# Altium schematic sheet Power_3V3_LDO.SchDoc
size A4
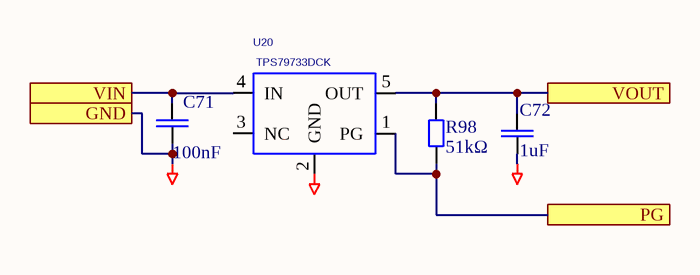
[diagram p0: Power_3V3_LDO.SchDoc]

## Parts
C71  100nF  [CAPC1608N]
C72  1uF  [CAPC2012N]
R98  51kΩ  [RESC2012N]
U20  TPS79733DCK  [SOT65P210X110-5N]

## Ports
GND, PG, VIN, VOUT

## Nets
GND: C71.1 C72.1 U20.2(GND) ; port GND
PG: R98.1 U20.1(PG) ; port PG
VIN: C71.2 U20.4(IN) ; port VIN
VOUT: C72.2 R98.2 U20.5(OUT) ; port VOUT

Not connected (* = marked no-connect by the designer): U20 3(NC)

## Library data of the parts
C71 = CAPC: Generic ceramic SMD capacitor; Pkg: 0603; Maintainer: Evgeniy Kotov; SMD Solders: 2; THD Solders: 0; PartField: 100nF; Last Change Data: 06.03.2017; Release Date: 06.03.2017; Value: 100nF
C72 = CAPC: Generic ceramic SMD capacitor; Pkg: 0805; Maintainer: Evgeniy Kotov; SMD Solders: 2; THD Solders: 0; Voltage Rating: 10V; PartField: 1uF; Last Change Data: 06.03.2017; Release Date: 06.03.2017; Value: 1uF
R98 = RESC: Resistor, Generic, SMD; Pkg: 0805; Maintainer: Evgeniy Kotov; SMD Solders: 2; THD Solders: 0; PartField: 51kΩ; Release Date: 06.03.2017; Last Change Data: 09.03.2017; Value: 51kΩ
U20 = TPS79733DCK: Ultra low power (Iq=1.2 mkA) LDO 3.3V Fixed; Vendor: Texas Instruments; PACKAGE_DESIGNATOR: MF; PIN_COUNT: 5; INDUSTRY_STD_PKG_TYPE: SC70-5; THD Solders: 0; Value: TPS79733DCK; Manufacturer_Part_Number: TPS79733DCK; GENERIC_PART_NUMBER: TPS79733DCK; FAMILY_NAME: LDO; HelpURL: http://www.ti.com/lit/ds/symlink/tps797.pdf; Manufacturer: Texas Instruments; Pkg: SC70-5; SMD Solders: 5; PartField: TPS79733DCK